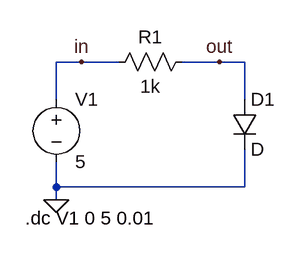
[diagram p0: schematic Task2.asc]
Task2.asc, the LTspice schematic file:
Version 4.1
SHEET 1 880 680
WIRE 160 80 128 80
WIRE 208 80 160 80
WIRE 336 80 288 80
WIRE 368 80 336 80
WIRE 128 128 128 80
WIRE 368 128 368 80
WIRE 128 240 128 208
WIRE 368 240 368 192
WIRE 368 240 128 240
WIRE 128 256 128 240
FLAG 128 256 0
FLAG 160 80 in
FLAG 336 80 out
SYMBOL res 304 64 R90
WINDOW 0 0 56 VBottom 2
WINDOW 3 32 56 VTop 2
SYMATTR InstName R1
SYMATTR Value 1k
SYMBOL diode 352 128 R0
SYMATTR InstName D1
SYMBOL voltage 128 112 R0
SYMATTR InstName V1
SYMATTR Value 5
TEXT 88 280 Left 2 !.dc V1 0 5 0.01\n

The netlist it stands for:
* Task2.asc
R1 out in 1k
D1 out 0 D
V1 in 0 5
.model D D
.lib standard.dio
.dc V1 0 5 0.01
.backanno
.end